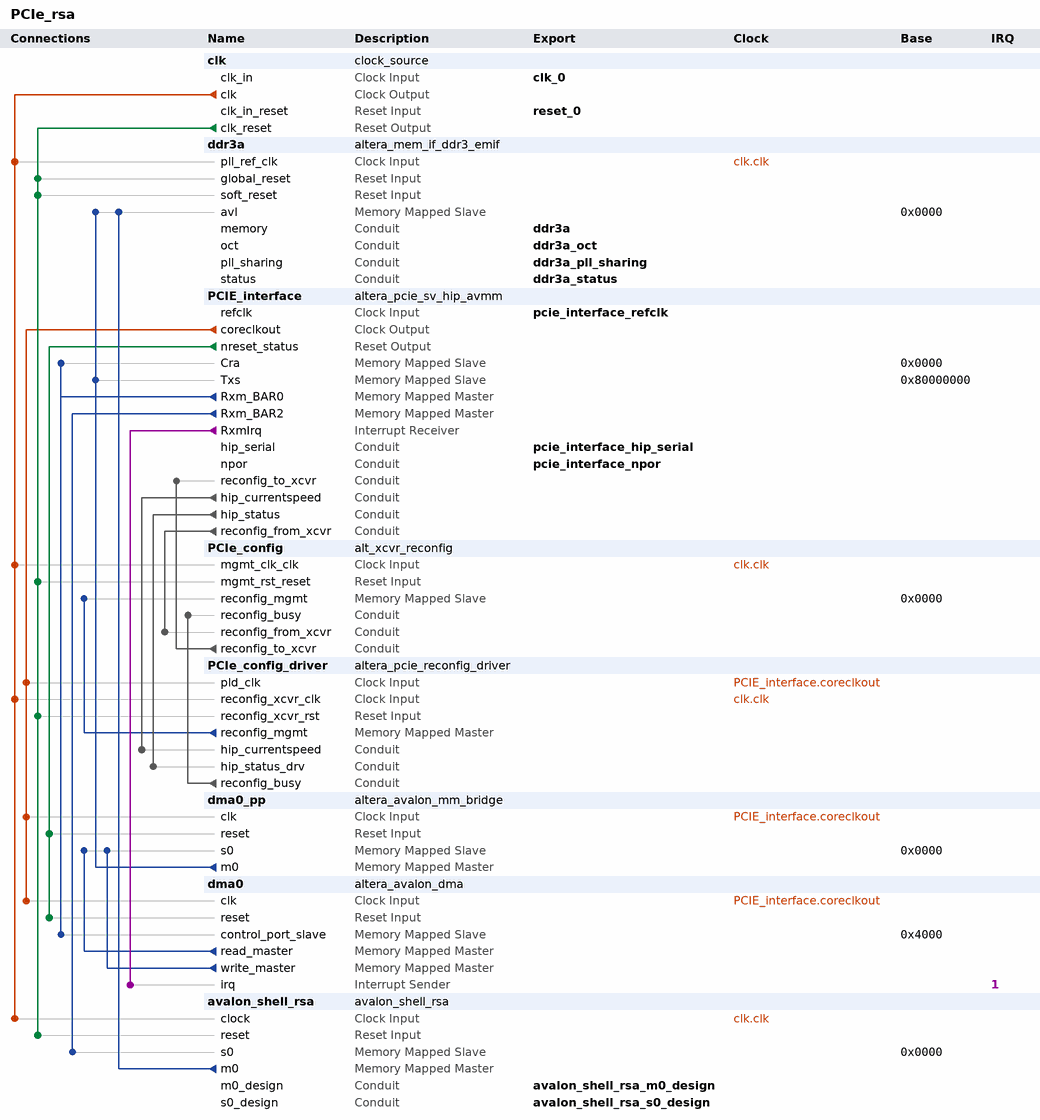
[diagram p0: system contents]
# Platform Designer (Qsys) system PCIe_rsa, Stratix V 5SGXEA7N2F45C2
# Parameters at their usual value, and those the tool derives, are not listed.
package require -exact qsys 14.1
create_system PCIe_rsa
set_project_property DEVICE_FAMILY {Stratix V}
set_project_property DEVICE 5SGXEA7N2F45C2

add_instance clk clock_source 14.1
set_instance_parameter_value clk clockFrequency 50000000

add_instance ddr3a altera_mem_if_ddr3_emif 14.1
set_instance_parameter_value ddr3a AVL_MAX_SIZE 512
set_instance_parameter_value ddr3a CALIBRATION_MODE Skip
set_instance_parameter_value ddr3a CPORT_TYPE_PORT Bidirectional,Bidirectional,Bidirectional,Bidirectional,Bidirectional,Bidirectional
set_instance_parameter_value ddr3a EXPORT_AFI_HALF_CLK false
set_instance_parameter_value ddr3a HARD_EMIF false
set_instance_parameter_value ddr3a MEM_BANKADDR_WIDTH 3
set_instance_parameter_value ddr3a MEM_CLK_FREQ 800.0
set_instance_parameter_value ddr3a MEM_CLK_FREQ_MAX 800.0
set_instance_parameter_value ddr3a MEM_COL_ADDR_WIDTH 10
set_instance_parameter_value ddr3a MEM_DQ_WIDTH 64
set_instance_parameter_value ddr3a MEM_FORMAT UNBUFFERED
set_instance_parameter_value ddr3a MEM_ROW_ADDR_WIDTH 15
set_instance_parameter_value ddr3a MEM_TCL 11
set_instance_parameter_value ddr3a MEM_TFAW_NS 30.0
set_instance_parameter_value ddr3a MEM_TRAS_NS 35.0
set_instance_parameter_value ddr3a MEM_TRCD_NS 13.75
set_instance_parameter_value ddr3a MEM_TRFC_NS 160.0
set_instance_parameter_value ddr3a MEM_TRP_NS 13.75
set_instance_parameter_value ddr3a MEM_TRRD_NS 6.0
set_instance_parameter_value ddr3a MEM_TRTP_NS 7.5
set_instance_parameter_value ddr3a MEM_TWTR 6
set_instance_parameter_value ddr3a MEM_VENDOR Micron
set_instance_parameter_value ddr3a MEM_WTCL 8
set_instance_parameter_value ddr3a PLL_LOCATION Top_Bottom
set_instance_parameter_value ddr3a POWER_OF_TWO_BUS true
set_instance_parameter_value ddr3a PRIORITY_PORT 1,1,1,1,1,1
set_instance_parameter_value ddr3a RATE Quarter
set_instance_parameter_value ddr3a REF_CLK_FREQ 50.0
set_instance_parameter_value ddr3a SPEED_GRADE 2
set_instance_parameter_value ddr3a TIMING_BOARD_AC_SKEW 0.05
set_instance_parameter_value ddr3a TIMING_BOARD_AC_TO_CK_SKEW 0.012
set_instance_parameter_value ddr3a TIMING_BOARD_DQ_TO_DQS_SKEW 0.002
set_instance_parameter_value ddr3a TIMING_BOARD_MAX_CK_DELAY 1.78
set_instance_parameter_value ddr3a TIMING_BOARD_MAX_DQS_DELAY 0.7
set_instance_parameter_value ddr3a TIMING_BOARD_SKEW_BETWEEN_DQS 0.1
set_instance_parameter_value ddr3a TIMING_BOARD_SKEW_CKDQS_DIMM_MAX 1.29
set_instance_parameter_value ddr3a TIMING_BOARD_SKEW_CKDQS_DIMM_MIN 0.06
set_instance_parameter_value ddr3a TIMING_BOARD_SKEW_WITHIN_DQS 0.009
set_instance_parameter_value ddr3a TIMING_TDH 45
set_instance_parameter_value ddr3a TIMING_TDQSCK 225
set_instance_parameter_value ddr3a TIMING_TDQSQ 100
set_instance_parameter_value ddr3a TIMING_TDQSS 0.27
set_instance_parameter_value ddr3a TIMING_TDS 10
set_instance_parameter_value ddr3a TIMING_TDSH 0.18
set_instance_parameter_value ddr3a TIMING_TDSS 0.18
set_instance_parameter_value ddr3a TIMING_TIH 120
set_instance_parameter_value ddr3a TIMING_TIS 170
set_instance_parameter_value ddr3a TIMING_TQSH 0.4
set_instance_parameter_value ddr3a USER_DEBUG_LEVEL 0

add_instance PCIE_interface altera_pcie_sv_hip_avmm 14.1
set_instance_parameter_value PCIE_interface AST_LITE 0
set_instance_parameter_value PCIE_interface AVALON_ADDR_WIDTH 32
set_instance_parameter_value PCIE_interface AddressPage "0\\,1\\,2\\,3\\,4\\,5\\,6\\,7\\,8\\,9\\,10\\,11\\,12\\,13\\,14\\,15"
set_instance_parameter_value PCIE_interface BYPASSS_A2P_TRANSLATION 0
set_instance_parameter_value PCIE_interface CB_A2P_ADDR_MAP_FIXED_TABLE_0_HIGH 0
set_instance_parameter_value PCIE_interface CB_A2P_ADDR_MAP_FIXED_TABLE_0_LOW 0
set_instance_parameter_value PCIE_interface CB_A2P_ADDR_MAP_FIXED_TABLE_10_HIGH 0
set_instance_parameter_value PCIE_interface CB_A2P_ADDR_MAP_FIXED_TABLE_10_LOW 0
set_instance_parameter_value PCIE_interface CB_A2P_ADDR_MAP_FIXED_TABLE_11_HIGH 0
set_instance_parameter_value PCIE_interface CB_A2P_ADDR_MAP_FIXED_TABLE_11_LOW 0
set_instance_parameter_value PCIE_interface CB_A2P_ADDR_MAP_FIXED_TABLE_12_HIGH 0
set_instance_parameter_value PCIE_interface CB_A2P_ADDR_MAP_FIXED_TABLE_12_LOW 0
set_instance_parameter_value PCIE_interface CB_A2P_ADDR_MAP_FIXED_TABLE_13_HIGH 0
set_instance_parameter_value PCIE_interface CB_A2P_ADDR_MAP_FIXED_TABLE_13_LOW 0
set_instance_parameter_value PCIE_interface CB_A2P_ADDR_MAP_FIXED_TABLE_14_HIGH 0
set_instance_parameter_value PCIE_interface CB_A2P_ADDR_MAP_FIXED_TABLE_14_LOW 0
set_instance_parameter_value PCIE_interface CB_A2P_ADDR_MAP_FIXED_TABLE_15_HIGH 0
set_instance_parameter_value PCIE_interface CB_A2P_ADDR_MAP_FIXED_TABLE_15_LOW 0
set_instance_parameter_value PCIE_interface CB_A2P_ADDR_MAP_FIXED_TABLE_1_HIGH 0
set_instance_parameter_value PCIE_interface CB_A2P_ADDR_MAP_FIXED_TABLE_1_LOW 0
set_instance_parameter_value PCIE_interface CB_A2P_ADDR_MAP_FIXED_TABLE_2_HIGH 0
set_instance_parameter_value PCIE_interface CB_A2P_ADDR_MAP_FIXED_TABLE_2_LOW 0
set_instance_parameter_value PCIE_interface CB_A2P_ADDR_MAP_FIXED_TABLE_3_HIGH 0
set_instance_parameter_value PCIE_interface CB_A2P_ADDR_MAP_FIXED_TABLE_3_LOW 0
set_instance_parameter_value PCIE_interface CB_A2P_ADDR_MAP_FIXED_TABLE_4_HIGH 0
set_instance_parameter_value PCIE_interface CB_A2P_ADDR_MAP_FIXED_TABLE_4_LOW 0
set_instance_parameter_value PCIE_interface CB_A2P_ADDR_MAP_FIXED_TABLE_5_HIGH 0
set_instance_parameter_value PCIE_interface CB_A2P_ADDR_MAP_FIXED_TABLE_5_LOW 0
set_instance_parameter_value PCIE_interface CB_A2P_ADDR_MAP_FIXED_TABLE_6_HIGH 0
set_instance_parameter_value PCIE_interface CB_A2P_ADDR_MAP_FIXED_TABLE_6_LOW 0
set_instance_parameter_value PCIE_interface CB_A2P_ADDR_MAP_FIXED_TABLE_7_HIGH 0
set_instance_parameter_value PCIE_interface CB_A2P_ADDR_MAP_FIXED_TABLE_7_LOW 0
set_instance_parameter_value PCIE_interface CB_A2P_ADDR_MAP_FIXED_TABLE_8_HIGH 0
set_instance_parameter_value PCIE_interface CB_A2P_ADDR_MAP_FIXED_TABLE_8_LOW 0
set_instance_parameter_value PCIE_interface CB_A2P_ADDR_MAP_FIXED_TABLE_9_HIGH 0
set_instance_parameter_value PCIE_interface CB_A2P_ADDR_MAP_FIXED_TABLE_9_LOW 0
set_instance_parameter_value PCIE_interface CB_A2P_ADDR_MAP_IS_FIXED 0
set_instance_parameter_value PCIE_interface CB_A2P_ADDR_MAP_NUM_ENTRIES 2
set_instance_parameter_value PCIE_interface CB_A2P_ADDR_MAP_PASS_THRU_BITS 30
set_instance_parameter_value PCIE_interface CB_P2A_AVALON_ADDR_B0 0x00000000
set_instance_parameter_value PCIE_interface CB_P2A_AVALON_ADDR_B1 0x00000000
set_instance_parameter_value PCIE_interface CB_P2A_AVALON_ADDR_B2 0x00000000
set_instance_parameter_value PCIE_interface CB_P2A_AVALON_ADDR_B3 0x00000000
set_instance_parameter_value PCIE_interface CB_P2A_AVALON_ADDR_B4 0x00000000
set_instance_parameter_value PCIE_interface CB_P2A_AVALON_ADDR_B5 0x00000000
set_instance_parameter_value PCIE_interface CB_P2A_FIXED_AVALON_ADDR_B0 0
set_instance_parameter_value PCIE_interface CB_P2A_FIXED_AVALON_ADDR_B1 0
set_instance_parameter_value PCIE_interface CB_P2A_FIXED_AVALON_ADDR_B2 0
set_instance_parameter_value PCIE_interface CB_P2A_FIXED_AVALON_ADDR_B3 0
set_instance_parameter_value PCIE_interface CB_P2A_FIXED_AVALON_ADDR_B4 0
set_instance_parameter_value PCIE_interface CB_P2A_FIXED_AVALON_ADDR_B5 0
set_instance_parameter_value PCIE_interface CB_PCIE_MODE 0
set_instance_parameter_value PCIE_interface CB_PCIE_RX_LITE 0
set_instance_parameter_value PCIE_interface CB_RP_S_ADDR_WIDTH 32
set_instance_parameter_value PCIE_interface CG_COMMON_CLOCK_MODE 1
set_instance_parameter_value PCIE_interface CG_ENABLE_A2P_INTERRUPT 0
set_instance_parameter_value PCIE_interface CG_ENABLE_ADVANCED_INTERRUPT 0
set_instance_parameter_value PCIE_interface CG_ENABLE_HIP_STATUS 1
set_instance_parameter_value PCIE_interface CG_ENABLE_HIP_STATUS_EXTENSION 0
set_instance_parameter_value PCIE_interface CG_IMPL_CRA_AV_SLAVE_PORT 1
set_instance_parameter_value PCIE_interface CG_RXM_IRQ_NUM 16
set_instance_parameter_value PCIE_interface NUM_PREFETCH_MASTERS 1
set_instance_parameter_value PCIE_interface PCIeAddress31_0 "0x00000000\\,0x00000000\\,0x00000000\\,0x00000000\\,0x00000000\\,0x00000000\\,0x00000000\\,0x00000000\\,0x00000000\\,0x00000000\\,0x00000000\\,0x00000000\\,0x00000000\\,0x00000000\\,0x00000000\\,0x00000000"
set_instance_parameter_value PCIE_interface PCIeAddress63_32 "0x00000000\\,0x00000000\\,0x00000000\\,0x00000000\\,0x00000000\\,0x00000000\\,0x00000000\\,0x00000000\\,0x00000000\\,0x00000000\\,0x00000000\\,0x00000000\\,0x00000000\\,0x00000000\\,0x00000000\\,0x00000000"
set_instance_parameter_value PCIE_interface RXM_BEN_WIDTH 8
set_instance_parameter_value PCIE_interface RXM_DATA_WIDTH 64
set_instance_parameter_value PCIE_interface SLAVE_ADDRESS_MAP_0 15
set_instance_parameter_value PCIE_interface SLAVE_ADDRESS_MAP_1 0
set_instance_parameter_value PCIE_interface SLAVE_ADDRESS_MAP_2 5
set_instance_parameter_value PCIE_interface SLAVE_ADDRESS_MAP_3 0
set_instance_parameter_value PCIE_interface SLAVE_ADDRESS_MAP_4 0
set_instance_parameter_value PCIE_interface SLAVE_ADDRESS_MAP_5 0
set_instance_parameter_value PCIE_interface TX_S_ADDR_WIDTH 32
set_instance_parameter_value PCIE_interface advanced_default_hwtcl_atomic_malformed true
set_instance_parameter_value PCIE_interface advanced_default_hwtcl_atomic_op_completer_32bit false
set_instance_parameter_value PCIE_interface advanced_default_hwtcl_atomic_op_completer_64bit false
set_instance_parameter_value PCIE_interface advanced_default_hwtcl_atomic_op_routing false
set_instance_parameter_value PCIE_interface advanced_default_hwtcl_bridge_port_ssid_support false
set_instance_parameter_value PCIE_interface advanced_default_hwtcl_bridge_port_vga_enable false
set_instance_parameter_value PCIE_interface advanced_default_hwtcl_bypass_cdc false
set_instance_parameter_value PCIE_interface advanced_default_hwtcl_cas_completer_128bit false
set_instance_parameter_value PCIE_interface advanced_default_hwtcl_cdc_dummy_insert_limit 11
set_instance_parameter_value PCIE_interface advanced_default_hwtcl_d0_pme false
set_instance_parameter_value PCIE_interface advanced_default_hwtcl_d1_pme false
set_instance_parameter_value PCIE_interface advanced_default_hwtcl_d1_support false
set_instance_parameter_value PCIE_interface advanced_default_hwtcl_d2_pme false
set_instance_parameter_value PCIE_interface advanced_default_hwtcl_d2_support false
set_instance_parameter_value PCIE_interface advanced_default_hwtcl_d3_cold_pme false
set_instance_parameter_value PCIE_interface advanced_default_hwtcl_d3_hot_pme false
set_instance_parameter_value PCIE_interface advanced_default_hwtcl_data_pack_rx disable
set_instance_parameter_value PCIE_interface advanced_default_hwtcl_deskew_comma com_deskw
set_instance_parameter_value PCIE_interface advanced_default_hwtcl_device_number 0
set_instance_parameter_value PCIE_interface advanced_default_hwtcl_disable_link_x2_support false
set_instance_parameter_value PCIE_interface advanced_default_hwtcl_disable_snoop_packet false
set_instance_parameter_value PCIE_interface advanced_default_hwtcl_ei_delay_powerdown_count 10
set_instance_parameter_value PCIE_interface advanced_default_hwtcl_eie_before_nfts_count 4
set_instance_parameter_value PCIE_interface advanced_default_hwtcl_enable_adapter_half_rate_mode false
set_instance_parameter_value PCIE_interface advanced_default_hwtcl_enable_l1_aspm false
set_instance_parameter_value PCIE_interface advanced_default_hwtcl_enable_rx_buffer_checking false
set_instance_parameter_value PCIE_interface advanced_default_hwtcl_extended_format_field false
set_instance_parameter_value PCIE_interface advanced_default_hwtcl_extended_tag_reset false
set_instance_parameter_value PCIE_interface advanced_default_hwtcl_fc_init_timer 1024
set_instance_parameter_value PCIE_interface advanced_default_hwtcl_flow_control_timeout_count 200
set_instance_parameter_value PCIE_interface advanced_default_hwtcl_flow_control_update_count 30
set_instance_parameter_value PCIE_interface advanced_default_hwtcl_flr_capability false
set_instance_parameter_value PCIE_interface advanced_default_hwtcl_gen2_diffclock_nfts_count 255
set_instance_parameter_value PCIE_interface advanced_default_hwtcl_gen2_sameclock_nfts_count 255
set_instance_parameter_value PCIE_interface advanced_default_hwtcl_hot_plug_support 0
set_instance_parameter_value PCIE_interface advanced_default_hwtcl_interrupt_pin inta
set_instance_parameter_value PCIE_interface advanced_default_hwtcl_l01_entry_latency 31
set_instance_parameter_value PCIE_interface advanced_default_hwtcl_l0_exit_latency_diffclock 6
set_instance_parameter_value PCIE_interface advanced_default_hwtcl_l0_exit_latency_sameclock 6
set_instance_parameter_value PCIE_interface advanced_default_hwtcl_l1_exit_latency_diffclock 0
set_instance_parameter_value PCIE_interface advanced_default_hwtcl_l1_exit_latency_sameclock 0
set_instance_parameter_value PCIE_interface advanced_default_hwtcl_low_priority_vc single_vc
set_instance_parameter_value PCIE_interface advanced_default_hwtcl_ltr_mechanism false
set_instance_parameter_value PCIE_interface advanced_default_hwtcl_ltssm_1ms_timeout disable
set_instance_parameter_value PCIE_interface advanced_default_hwtcl_ltssm_freqlocked_check disable
set_instance_parameter_value PCIE_interface advanced_default_hwtcl_maximum_current 0
set_instance_parameter_value PCIE_interface advanced_default_hwtcl_no_command_completed false
set_instance_parameter_value PCIE_interface advanced_default_hwtcl_no_soft_reset false
set_instance_parameter_value PCIE_interface advanced_default_hwtcl_pclk_out_sel pclk
set_instance_parameter_value PCIE_interface advanced_default_hwtcl_pipex1_debug_sel disable
set_instance_parameter_value PCIE_interface advanced_default_hwtcl_register_pipe_signals false
set_instance_parameter_value PCIE_interface advanced_default_hwtcl_reserved_debug 0
set_instance_parameter_value PCIE_interface advanced_default_hwtcl_retry_buffer_last_active_address 2047
set_instance_parameter_value PCIE_interface advanced_default_hwtcl_rx_l0s_count_idl 0
set_instance_parameter_value PCIE_interface advanced_default_hwtcl_set_l0s 0
set_instance_parameter_value PCIE_interface advanced_default_hwtcl_skp_os_gen3_count 0
set_instance_parameter_value PCIE_interface advanced_default_hwtcl_skp_os_schedule_count 0
set_instance_parameter_value PCIE_interface advanced_default_hwtcl_ssid 0
set_instance_parameter_value PCIE_interface advanced_default_hwtcl_ssvid 0
set_instance_parameter_value PCIE_interface advanced_default_hwtcl_tph_completer false
set_instance_parameter_value PCIE_interface advanced_default_hwtcl_tx_cdc_almost_empty 5
set_instance_parameter_value PCIE_interface advanced_default_hwtcl_vc0_clk_enable true
set_instance_parameter_value PCIE_interface advanced_default_hwtcl_wrong_device_id disable
set_instance_parameter_value PCIE_interface advanced_default_parameter_override 0
set_instance_parameter_value PCIE_interface avmm_width_hwtcl 128
set_instance_parameter_value PCIE_interface bar0_type_hwtcl 2
set_instance_parameter_value PCIE_interface bar1_type_hwtcl 0
set_instance_parameter_value PCIE_interface bar2_type_hwtcl 2
set_instance_parameter_value PCIE_interface bar3_type_hwtcl 0
set_instance_parameter_value PCIE_interface bar4_type_hwtcl 0
set_instance_parameter_value PCIE_interface bar5_type_hwtcl 0
set_instance_parameter_value PCIE_interface bypass_tl false
set_instance_parameter_value PCIE_interface class_code_hwtcl 0
set_instance_parameter_value PCIE_interface completion_timeout_hwtcl ABCD
set_instance_parameter_value PCIE_interface device_id_hwtcl 21862
set_instance_parameter_value PCIE_interface dll_active_report_support_hwtcl 0
set_instance_parameter_value PCIE_interface ecrc_check_capable_hwtcl 0
set_instance_parameter_value PCIE_interface ecrc_gen_capable_hwtcl 0
set_instance_parameter_value PCIE_interface enable_completion_timeout_disable_hwtcl 1
set_instance_parameter_value PCIE_interface enable_function_msix_support_hwtcl 0
set_instance_parameter_value PCIE_interface enable_pcisigtest_hwtcl 0
set_instance_parameter_value PCIE_interface enable_power_on_rst_pulse_hwtcl 0
set_instance_parameter_value PCIE_interface enable_slot_register_hwtcl 0
set_instance_parameter_value PCIE_interface enable_tl_only_sim_hwtcl 0
set_instance_parameter_value PCIE_interface endpoint_l0_latency_hwtcl 0
set_instance_parameter_value PCIE_interface endpoint_l1_latency_hwtcl 0
set_instance_parameter_value PCIE_interface expansion_base_address_register_hwtcl 0
set_instance_parameter_value PCIE_interface extend_tag_field_hwtcl 32
set_instance_parameter_value PCIE_interface fixed_address_mode 0
set_instance_parameter_value PCIE_interface force_hrc 0
set_instance_parameter_value PCIE_interface force_src 0
set_instance_parameter_value PCIE_interface gen123_lane_rate_mode_hwtcl {Gen2 (5.0 Gbps)}
set_instance_parameter_value PCIE_interface gen3_rxfreqlock_counter_hwtcl 0
set_instance_parameter_value PCIE_interface hip_reconfig_hwtcl 0
set_instance_parameter_value PCIE_interface hip_tag_checking_hwtcl 1
set_instance_parameter_value PCIE_interface hwtcl_override_g2_txvod 1
set_instance_parameter_value PCIE_interface in_cvp_mode_hwtcl 0
set_instance_parameter_value PCIE_interface io_window_addr_width_hwtcl 0
set_instance_parameter_value PCIE_interface lane_mask_hwtcl x8
set_instance_parameter_value PCIE_interface max_payload_size_hwtcl 256
set_instance_parameter_value PCIE_interface msi_64bit_addressing_capable_hwtcl true
set_instance_parameter_value PCIE_interface msi_masking_capable_hwtcl false
set_instance_parameter_value PCIE_interface msi_multi_message_capable_hwtcl 4
set_instance_parameter_value PCIE_interface msi_support_hwtcl true
set_instance_parameter_value PCIE_interface msix_pba_bir_hwtcl 0
set_instance_parameter_value PCIE_interface msix_pba_offset_hwtcl 0
set_instance_parameter_value PCIE_interface msix_table_bir_hwtcl 0
set_instance_parameter_value PCIE_interface msix_table_offset_hwtcl 0
set_instance_parameter_value PCIE_interface msix_table_size_hwtcl 0
set_instance_parameter_value PCIE_interface override_rxbuffer_cred_preset 0
set_instance_parameter_value PCIE_interface override_tbpartner_driver_setting_hwtcl 0
set_instance_parameter_value PCIE_interface pcie_inspector_hwtcl 0
set_instance_parameter_value PCIE_interface pcie_qsys 1
set_instance_parameter_value PCIE_interface pll_refclk_freq_hwtcl {100 MHz}
set_instance_parameter_value PCIE_interface port_link_number_hwtcl 1
set_instance_parameter_value PCIE_interface port_type_hwtcl {Native endpoint}
set_instance_parameter_value PCIE_interface prefetchable_mem_window_addr_width_hwtcl 0
set_instance_parameter_value PCIE_interface revision_id_hwtcl 1
set_instance_parameter_value PCIE_interface rpre_emph_a_val_hwtcl 9
set_instance_parameter_value PCIE_interface rpre_emph_b_val_hwtcl 0
set_instance_parameter_value PCIE_interface rpre_emph_c_val_hwtcl 16
set_instance_parameter_value PCIE_interface rpre_emph_d_val_hwtcl 13
set_instance_parameter_value PCIE_interface rpre_emph_e_val_hwtcl 5
set_instance_parameter_value PCIE_interface rvod_sel_a_val_hwtcl 42
set_instance_parameter_value PCIE_interface rvod_sel_b_val_hwtcl 38
set_instance_parameter_value PCIE_interface rvod_sel_c_val_hwtcl 38
set_instance_parameter_value PCIE_interface rvod_sel_d_val_hwtcl 43
set_instance_parameter_value PCIE_interface rvod_sel_e_val_hwtcl 15
set_instance_parameter_value PCIE_interface rxbuffer_rxreq_hwtcl Low
set_instance_parameter_value PCIE_interface serial_sim_hwtcl 1
set_instance_parameter_value PCIE_interface set_pld_clk_x1_625MHz_hwtcl 0
set_instance_parameter_value PCIE_interface slot_number_hwtcl 0
set_instance_parameter_value PCIE_interface slot_power_limit_hwtcl 0
set_instance_parameter_value PCIE_interface slot_power_scale_hwtcl 0
set_instance_parameter_value PCIE_interface slotclkcfg_hwtcl 1
set_instance_parameter_value PCIE_interface subsystem_device_id_hwtcl 9509
set_instance_parameter_value PCIE_interface subsystem_vendor_id_hwtcl 9509
set_instance_parameter_value PCIE_interface surprise_down_error_support_hwtcl 0
set_instance_parameter_value PCIE_interface tlp_insp_trg_dw0_hwtcl 2049
set_instance_parameter_value PCIE_interface tlp_insp_trg_dw1_hwtcl 0
set_instance_parameter_value PCIE_interface tlp_insp_trg_dw2_hwtcl 0
set_instance_parameter_value PCIE_interface tlp_insp_trg_dw3_hwtcl 0
set_instance_parameter_value PCIE_interface tlp_inspector_hwtcl 0
set_instance_parameter_value PCIE_interface tlp_inspector_use_signal_probe_hwtcl 0
set_instance_parameter_value PCIE_interface use_aer_hwtcl 0
set_instance_parameter_value PCIE_interface use_ast_parity 0
set_instance_parameter_value PCIE_interface use_atx_pll_hwtcl 0
set_instance_parameter_value PCIE_interface use_crc_forwarding_hwtcl 0
set_instance_parameter_value PCIE_interface use_cvp_update_core_pof_hwtcl 0
set_instance_parameter_value PCIE_interface use_rx_st_be_hwtcl 0
set_instance_parameter_value PCIE_interface vendor_id_hwtcl 4466
set_instance_parameter_value PCIE_interface vsec_id_hwtcl 40960
set_instance_parameter_value PCIE_interface vsec_rev_hwtcl 0

add_instance PCIe_config alt_xcvr_reconfig 14.1
set_instance_parameter_value PCIe_config device_family {Stratix V}
set_instance_parameter_value PCIe_config enable_adce 0
set_instance_parameter_value PCIe_config enable_analog 1
set_instance_parameter_value PCIe_config number_of_reconfig_interfaces 10

add_instance PCIe_config_driver altera_pcie_reconfig_driver 14.1
set_instance_parameter_value PCIe_config_driver gen123_lane_rate_mode_hwtcl {Gen2 (5.0 Gbps)}
set_instance_parameter_value PCIe_config_driver number_of_reconfig_interfaces 10

add_instance dma0_pp altera_avalon_mm_bridge 14.1
set_instance_parameter_value dma0_pp ADDRESS_UNITS SYMBOLS
set_instance_parameter_value dma0_pp ADDRESS_WIDTH 10
set_instance_parameter_value dma0_pp DATA_WIDTH 128
set_instance_parameter_value dma0_pp MAX_BURST_SIZE 512
set_instance_parameter_value dma0_pp MAX_PENDING_RESPONSES 4
set_instance_parameter_value dma0_pp USE_AUTO_ADDRESS_WIDTH 1

add_instance dma0 altera_avalon_dma 14.1
set_instance_parameter_value dma0 allowByteTransactions false
set_instance_parameter_value dma0 allowDoubleWordTransactions false
set_instance_parameter_value dma0 allowHalfWordTransactions false
set_instance_parameter_value dma0 allowQuadWordTransactions true
set_instance_parameter_value dma0 allowWordTransactions false
set_instance_parameter_value dma0 burstEnable true
set_instance_parameter_value dma0 fifoDepth 64
set_instance_parameter_value dma0 maxBurstSize 512
set_instance_parameter_value dma0 minimumDmaTransactionRegisterWidth 13

add_instance avalon_shell_rsa avalon_shell_rsa 3.0

# connections
add_connection clk.clk avalon_shell_rsa.clock clock
add_connection clk.clk ddr3a.pll_ref_clk clock
add_connection clk.clk PCIe_config.mgmt_clk_clk clock
add_connection clk.clk PCIe_config_driver.reconfig_xcvr_clk clock
add_connection PCIE_interface.coreclkout dma0.clk clock
add_connection PCIE_interface.coreclkout dma0_pp.clk clock
add_connection PCIE_interface.coreclkout PCIe_config_driver.pld_clk clock
add_connection clk.clk_reset avalon_shell_rsa.reset reset
add_connection clk.clk_reset ddr3a.global_reset reset
add_connection clk.clk_reset ddr3a.soft_reset reset
add_connection clk.clk_reset PCIe_config.mgmt_rst_reset reset
add_connection clk.clk_reset PCIe_config_driver.reconfig_xcvr_rst reset
add_connection PCIE_interface.nreset_status dma0.reset reset
add_connection PCIE_interface.nreset_status dma0_pp.reset reset
add_connection avalon_shell_rsa.m0 ddr3a.avl avalon
set_connection_parameter_value avalon_shell_rsa.m0/ddr3a.avl baseAddress 0x0000
add_connection dma0.read_master dma0_pp.s0 avalon
set_connection_parameter_value dma0.read_master/dma0_pp.s0 baseAddress 0x0000
add_connection dma0.write_master dma0_pp.s0 avalon
set_connection_parameter_value dma0.write_master/dma0_pp.s0 baseAddress 0x0000
add_connection dma0_pp.m0 ddr3a.avl avalon
set_connection_parameter_value dma0_pp.m0/ddr3a.avl baseAddress 0x0000
add_connection dma0_pp.m0 PCIE_interface.Txs avalon
set_connection_parameter_value dma0_pp.m0/PCIE_interface.Txs baseAddress 0x80000000
add_connection PCIe_config_driver.reconfig_mgmt PCIe_config.reconfig_mgmt avalon
set_connection_parameter_value PCIe_config_driver.reconfig_mgmt/PCIe_config.reconfig_mgmt baseAddress 0x0000
add_connection PCIE_interface.Rxm_BAR0 dma0.control_port_slave avalon
set_connection_parameter_value PCIE_interface.Rxm_BAR0/dma0.control_port_slave baseAddress 0x4000
add_connection PCIE_interface.Rxm_BAR0 PCIE_interface.Cra avalon
set_connection_parameter_value PCIE_interface.Rxm_BAR0/PCIE_interface.Cra baseAddress 0x0000
add_connection PCIE_interface.Rxm_BAR2 avalon_shell_rsa.s0 avalon
set_connection_parameter_value PCIE_interface.Rxm_BAR2/avalon_shell_rsa.s0 baseAddress 0x0000
add_connection PCIe_config.reconfig_to_xcvr PCIE_interface.reconfig_to_xcvr conduit
add_connection PCIe_config_driver.reconfig_busy PCIe_config.reconfig_busy conduit
add_connection PCIE_interface.hip_currentspeed PCIe_config_driver.hip_currentspeed conduit
add_connection PCIE_interface.hip_status PCIe_config_driver.hip_status_drv conduit
add_connection PCIE_interface.reconfig_from_xcvr PCIe_config.reconfig_from_xcvr conduit
add_connection PCIE_interface.RxmIrq dma0.irq interrupt
set_connection_parameter_value PCIE_interface.RxmIrq/dma0.irq irqNumber 1

# exported interfaces
add_interface avalon_shell_rsa_m0_design conduit end
set_interface_property avalon_shell_rsa_m0_design EXPORT_OF avalon_shell_rsa.m0_design
add_interface avalon_shell_rsa_s0_design conduit end
set_interface_property avalon_shell_rsa_s0_design EXPORT_OF avalon_shell_rsa.s0_design
add_interface clk_0 clock sink
set_interface_property clk_0 EXPORT_OF clk.clk_in
add_interface ddr3a conduit end
set_interface_property ddr3a EXPORT_OF ddr3a.memory
add_interface ddr3a_oct conduit end
set_interface_property ddr3a_oct EXPORT_OF ddr3a.oct
add_interface ddr3a_pll_sharing conduit end
set_interface_property ddr3a_pll_sharing EXPORT_OF ddr3a.pll_sharing
add_interface ddr3a_status conduit end
set_interface_property ddr3a_status EXPORT_OF ddr3a.status
add_interface pcie_interface_hip_serial conduit end
set_interface_property pcie_interface_hip_serial EXPORT_OF PCIE_interface.hip_serial
add_interface pcie_interface_npor conduit end
set_interface_property pcie_interface_npor EXPORT_OF PCIE_interface.npor
add_interface pcie_interface_refclk clock sink
set_interface_property pcie_interface_refclk EXPORT_OF PCIE_interface.refclk
add_interface reset_0 reset sink
set_interface_property reset_0 EXPORT_OF clk.clk_in_reset

set_interconnect_requirement {$system} qsys_mm.clockCrossingAdapter HANDSHAKE
set_interconnect_requirement {$system} qsys_mm.insertDefaultSlave FALSE
set_interconnect_requirement {$system} qsys_mm.maxAdditionalLatency 1

save_system PCIe_rsa.qsys
